# Altium project Smart_Podium.PrjPcb
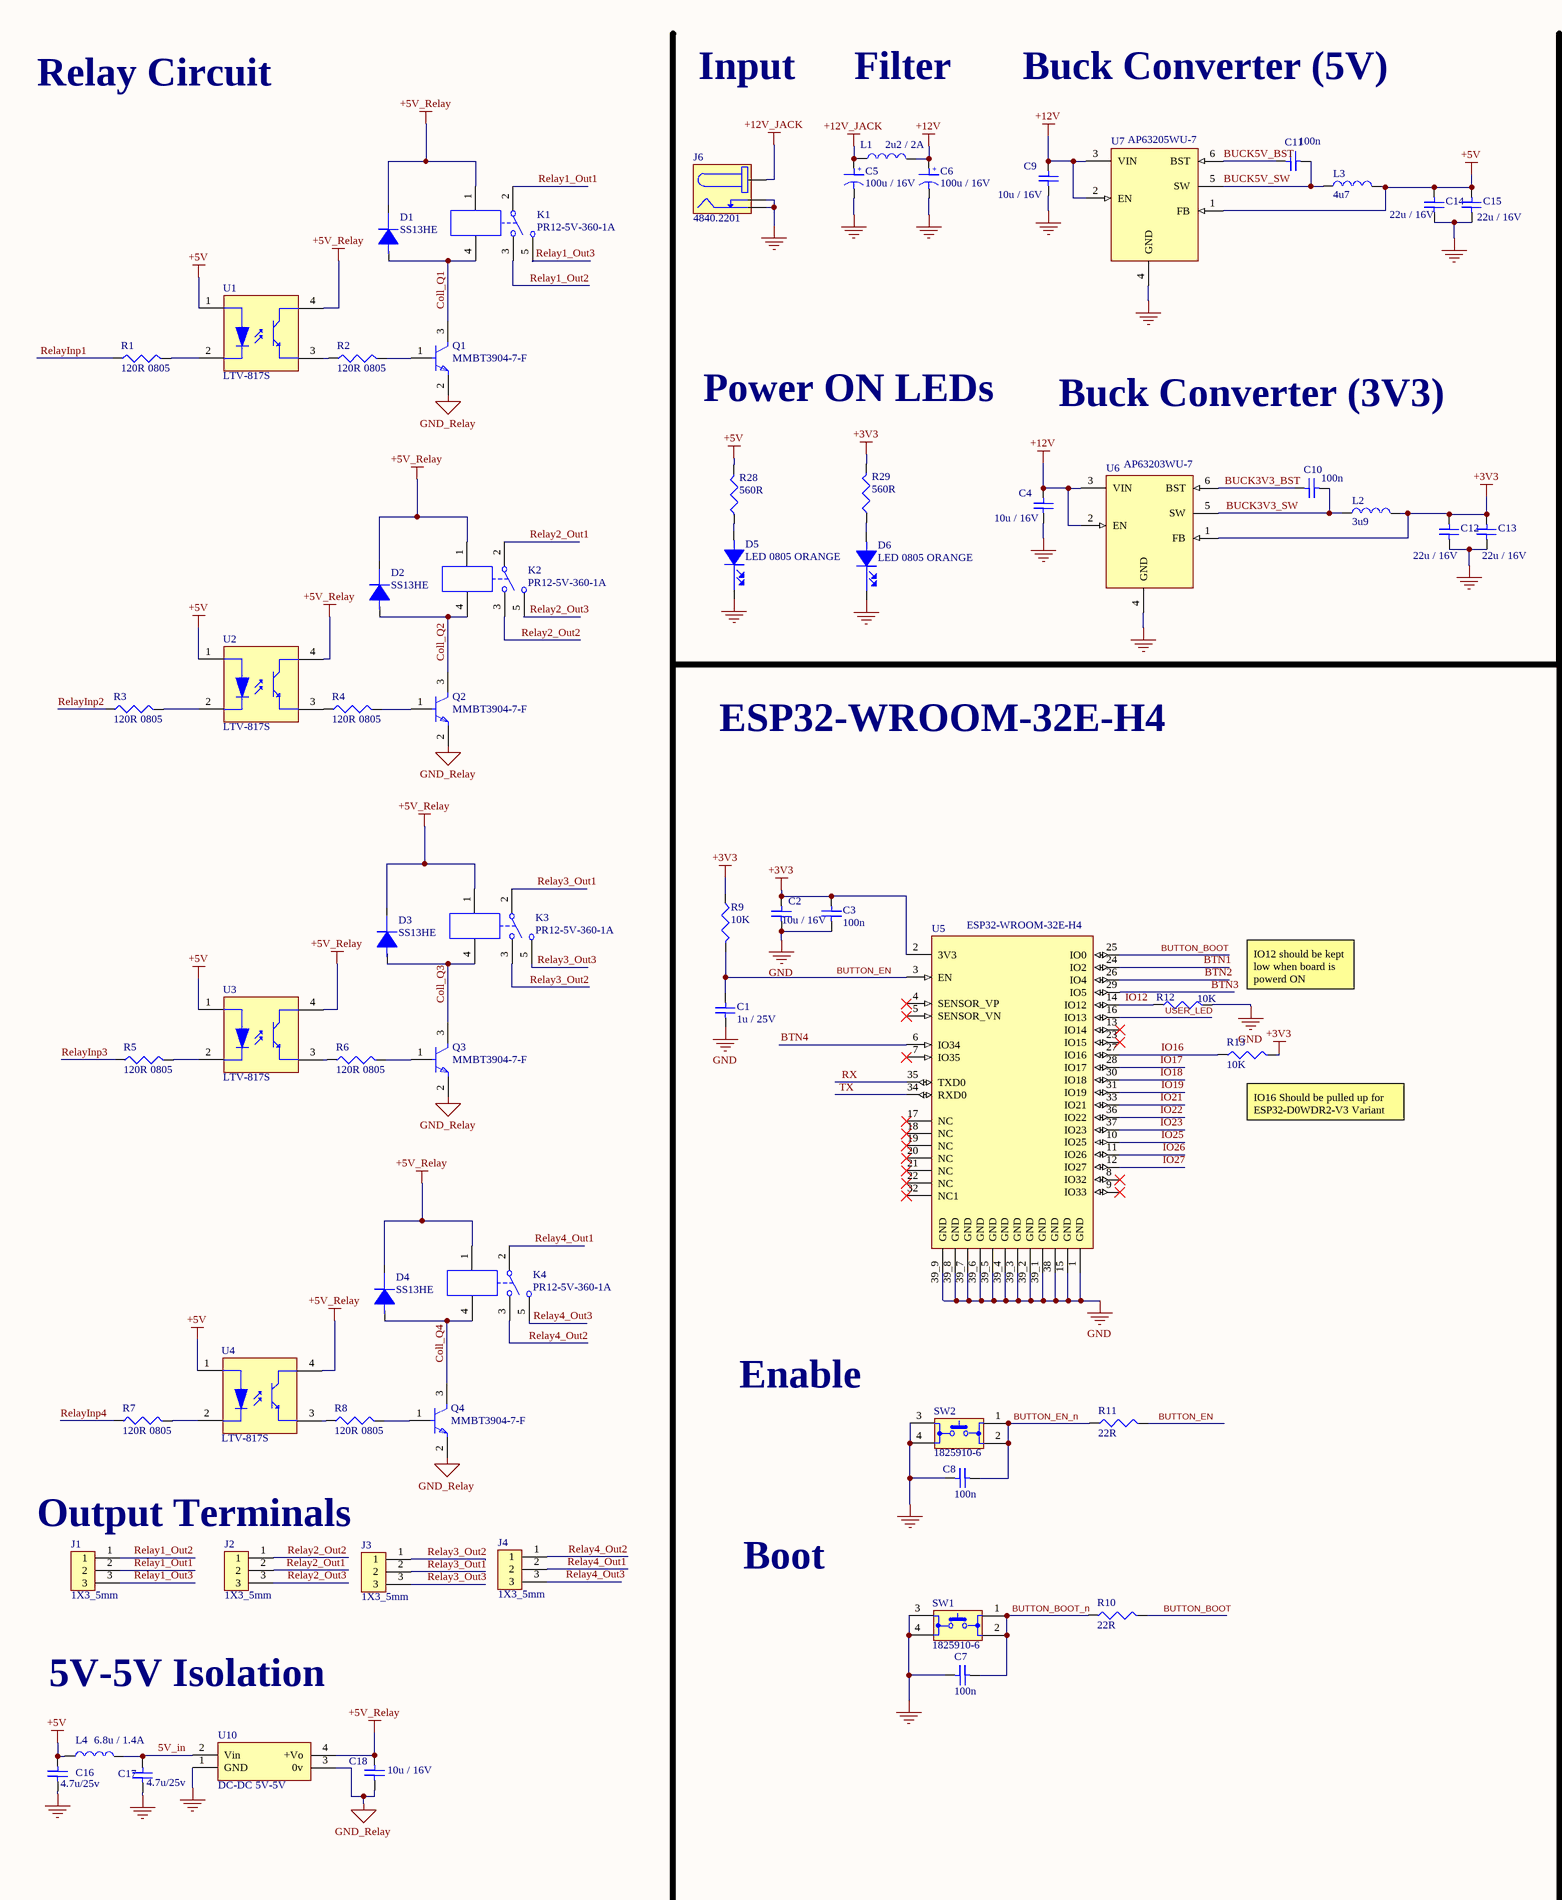
[diagram p0: Smart_Podium_Circuit.SchDoc, left]
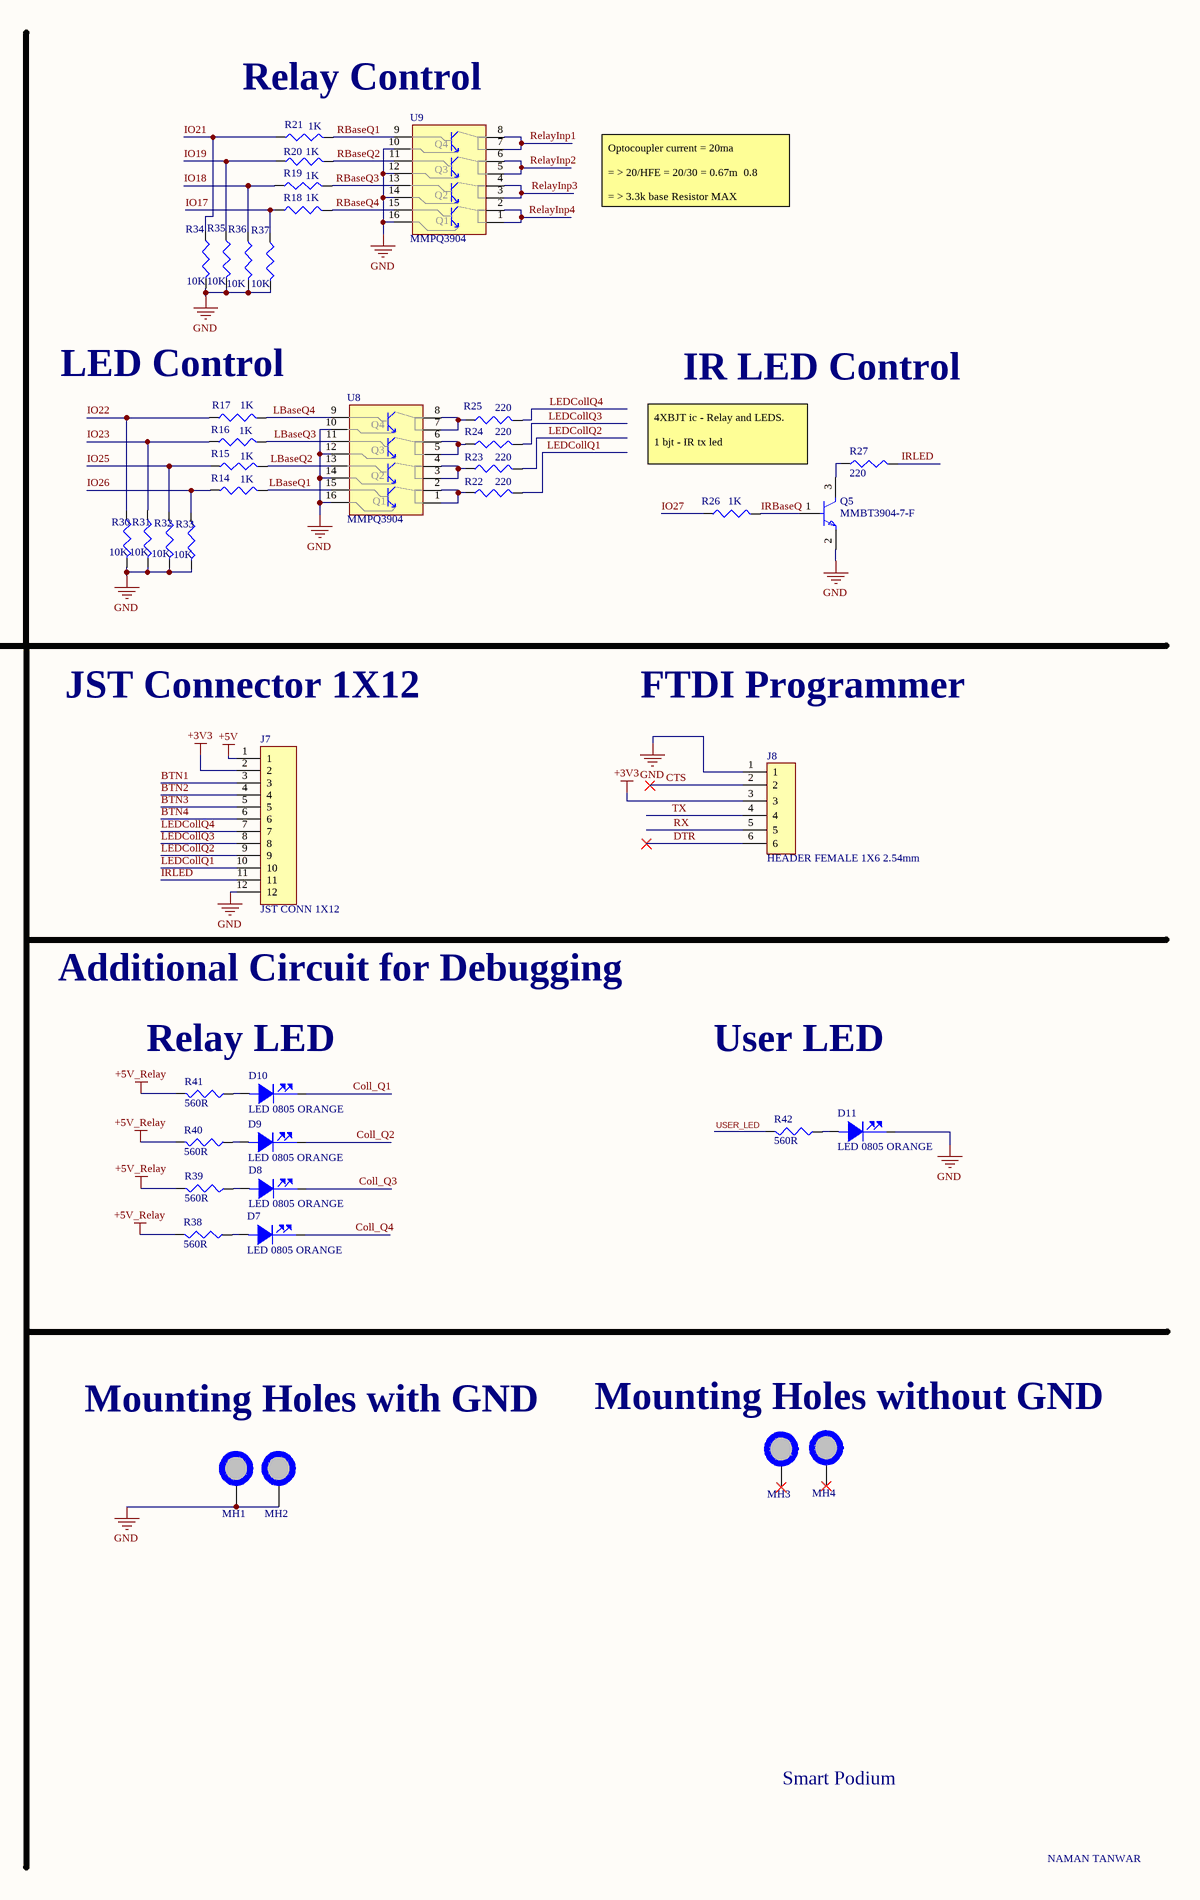
[diagram p1: Smart_Podium_Circuit.SchDoc, right]
1 sheet, 107 parts. Net scope: global (net labels, ports and power ports of the same name join across sheets).
Board file: Smart_Podium.PcbDoc

## Sheet Smart_Podium_Circuit.SchDoc
size A2; SheetNumber: 1; SheetTotal: 1

### Parts
C1  1u / 25V  [C0805]
C2  10u / 16V  [C0805]
C3  100n  [C0805]
C4  10u / 16V  [C0805]
C5  100u / 16V  [C_ALU_C_SIZE]
C6  100u / 16V  [C_ALU_C_SIZE]
C7  100n  [C0805]
C8  100n  [C0805]
C9  10u / 16V  [C0805]
C10  100n  [C0805]
C11  100n  [C0805]
C12  22u / 16V  [C0805]
C13  22u / 16V  [C0805]
C14  22u / 16V  [C0805]
C15  22u / 16V  [C0805]
C16  4.7u/25v  [C0805]
C17  4.7u/25v  [C0805]
C18  10u / 16V  [C0805]
D1  SS13HE  [SOD323HE]
D2  SS13HE  [SOD323HE]
D3  SS13HE  [SOD323HE]
D4  SS13HE  [SOD323HE]
D5  LED 0805 ORANGE  [LED_0805]
D6  LED 0805 ORANGE  [LED_0805]
D7  LED 0805 ORANGE  [LED_0805]
D8  LED 0805 ORANGE  [LED_0805]
D9  LED 0805 ORANGE  [LED_0805]
D10  LED 0805 ORANGE  [LED_0805]
D11  LED 0805 ORANGE  [LED_0805]
J1  1X3_5mm  [SSCREW_CONN_5MM_1X3]
J2  1X3_5mm  [SSCREW_CONN_5MM_1X3]
J3  1X3_5mm  [SSCREW_CONN_5MM_1X3]
J4  1X3_5mm  [SSCREW_CONN_5MM_1X3]
J6  4840.2201  [DC_JACK]
J7  JST CONN 1X12  [FP-B12B-XH-A_LF_SN-MFG]
J8  HEADER FEMALE 1X6 2.54mm  [Header_Female_1x6_2.54mm]
K1  PR12-5V-360-1A  [Relay_SPST]
K2  PR12-5V-360-1A  [Relay_SPST]
K3  PR12-5V-360-1A  [Relay_SPST]
K4  PR12-5V-360-1A  [Relay_SPST]
L1  2u2 / 2A  [C1210_IND]
L2  3u9  [3u9_IND_NON_STANDARD]
L3  4u7  [4u7_IND_NON_STANDARD]
L4  6.8u / 1.4A  [C1210_IND]
MH1  MH_7.4MMC_3.2MMD  [MH_7.4MMC_3.2MMD]  (value not drawn)  (no BOM)
MH2  MH_7.4MMC_3.2MMD  [MH_7.4MMC_3.2MMD]  (value not drawn)  (no BOM)
MH3  MH_7.4MMNC_3.2MMD  [MH_7.4MMC_3.2MMD_NON_COPPER_NPTH]  (value not drawn)  (no BOM)
MH4  MH_7.4MMNC_3.2MMD  [MH_7.4MMC_3.2MMD_NON_COPPER_NPTH]  (value not drawn)  (no BOM)
Q1  MMBT3904-7-F  [FP-SOT23-IPC_A]
Q2  MMBT3904-7-F  [FP-SOT23-IPC_A]
Q3  MMBT3904-7-F  [FP-SOT23-IPC_A]
Q4  MMBT3904-7-F  [FP-SOT23-IPC_A]
Q5  MMBT3904-7-F  [FP-SOT23-IPC_A]
R1  120R 0805  [R0805]
R2  120R 0805  [R0805]
R3  120R 0805  [R0805]
R4  120R 0805  [R0805]
R5  120R 0805  [R0805]
R6  120R 0805  [R0805]
R7  120R 0805  [R0805]
R8  120R 0805  [R0805]
R9  10K  [R0805]
R10  22R  [R0805]
R11  22R  [R0805]
R12  10K  [R0805]
R13  10K  [R0805]
R14  1K  [R0805]
R15  1K  [R0805]
R16  1K  [R0805]
R17  1K  [R0805]
R18  1K  [R0805]
R19  1K  [R0805]
R20  1K  [R0805]
R21  1K  [R0805]
R22  220  [R0805]
R23  220  [R0805]
R24  220  [R0805]
R25  220  [R0805]
R26  1K  [R0805]
R27  220  [R0805]
R28  560R  [R0805]
R29  560R  [R0805]
R30  10K  [R0805]
R31  10K  [R0805]
R32  10K  [R0805]
R33  10K  [R0805]
R34  10K  [R0805]
R35  10K  [R0805]
R36  10K  [R0805]
R37  10K  [R0805]
R38  560R  [R0805]
R39  560R  [R0805]
R40  560R  [R0805]
R41  560R  [R0805]
R42  560R  [R0805]
SW1  1825910-6  [1825910-6]
SW2  1825910-6  [1825910-6]
U1  LTV-817S  [LTST-LTV-817S-4_V]
U2  LTV-817S  [LTST-LTV-817S-4_V]
U3  LTV-817S  [LTST-LTV-817S-4_V]
U4  LTV-817S  [LTST-LTV-817S-4_V]
U5  ESP32-WROOM-32E-H4  [XCVR_ESP32-WROOM-32E_(4MB_HIGH_TEMP)]
U6  AP63203WU-7  [FP-TSOT26-MFG]
U7  AP63205WU-7  [FP-TSOT26-MFG]
U8  MMPQ3904  [16SOIC]
U9  MMPQ3904  [16SOIC]
U10  DC-DC 5V-5V  [DC-DC isolator 1x4 pins]

### Nets
+3V3: C2.2 C3.1 C12.2 C13.2 J7.2 J8.3 L2.2 R9.1 R13.2 R29.2 U5.2(3V3) U6.1(FB)
+5V: C14.2 C15.2 C16.2 J7.1 L3.2 L4.1 R28.2 U1.1(ANODE) U2.1(ANODE) U3.1(ANODE) U4.1(ANODE) U7.1(FB)
+5V_Relay: C18.2 D1.1(Cathode) D2.1(Cathode) D3.1(Cathode) D4.1(Cathode) K1.1 K2.1 K3.1 K4.1 R38.2 R39.2 R40.2 R41.2 U1.4(COLLECTOR) U2.4(COLLECTOR) U3.4(COLLECTOR) U4.4(COLLECTOR) U10.4(+Vo)
+12V: C4.2 C6.1 C9.2 L1.2 U6.2(EN) U6.3(VIN) U7.2(EN) U7.3(VIN)
+12V_JACK: C5.1 J6.1 L1.1
GND: C1.1 C2.1 C3.2 C4.1 C5.2 C6.2 C7.1 C8.1 C9.1 C12.1 C13.1 C14.1 C15.1 C16.1 C17.1 D5.1(Cathode) D6.1(Cathode) D11.1(Cathode) J6.2 J6.3 J7.12 J8.1 MH1.1 MH2.1 Q5.2(E) R12.2 R30.2 R31.2 R32.2 R33.2 R34.2 R35.2 R36.2 R37.2 SW1.3 SW1.4 SW2.3 SW2.4 U5.1(GND) U5.15(GND) U5.38(GND) U5.39_1(GND) U5.39_2(GND) U5.39_3(GND) U5.39_4(GND) U5.39_5(GND) U5.39_6(GND) U5.39_7(GND) U5.39_8(GND) U5.39_9(GND) U6.4(GND) U7.4(GND) U8.10 U8.12 U8.14 U8.16 U9.10 U9.12 U9.14 U9.16 U10.1(GND)
GND_Relay: C18.1 Q1.2(E) Q2.2(E) Q3.2(E) Q4.2(E) U10.3(0v)
5V_in: C17.2 L4.2 U10.2(Vin)
BTN1: J7.3 U5.24(IO2)
BTN2: J7.4 U5.26(IO4)
BTN3: J7.5 U5.29(IO5)
BTN4: J7.6 U5.6(IO34)
BUCK3V3_BST: C10.2 U6.6(BST)
BUCK3V3_SW: C10.1 L2.1 U6.5(SW)
BUCK5V_BST: C11.2 U7.6(BST)
BUCK5V_SW: C11.1 L3.1 U7.5(SW)
BUTTON_BOOT: R10.2 U5.25(IO0)
BUTTON_BOOT_n: C7.2 R10.1 SW1.1 SW1.2
BUTTON_EN: C1.2 R9.2 R11.2 U5.3(EN)
BUTTON_EN_n: C8.2 R11.1 SW2.1 SW2.2
Coll_Q1: D1.2(Anode) D10.1(Cathode) K1.4 Q1.3(C)
Coll_Q2: D2.2(Anode) D9.1(Cathode) K2.4 Q2.3(C)
Coll_Q3: D3.2(Anode) D8.1(Cathode) K3.4 Q3.3(C)
Coll_Q4: D4.2(Anode) D7.1(Cathode) K4.4 Q4.3(C)
CTS: J8.2
DTR: J8.6
IO12: R12.1 U5.14(IO12)
IO16: R13.1 U5.27(IO16)
IO17: R18.1 R37.1 U5.28(IO17)
IO18: R19.1 R36.1 U5.30(IO18)
IO19: R20.1 R35.1 U5.31(IO19)
IO21: R21.1 R34.1 U5.33(IO21)
IO22: R17.1 R30.1 U5.36(IO22)
IO23: R16.1 R31.1 U5.37(IO23)
IO25: R15.1 R32.1 U5.10(IO25)
IO26: R14.1 R33.1 U5.11(IO26)
IO27: R26.1 U5.12(IO27)
IRBaseQ: Q5.1(B) R26.2
IRLED: J7.11 R27.2
LBaseQ1: R14.2 U8.15
LBaseQ2: R15.2 U8.13
LBaseQ3: R16.2 U8.11
LBaseQ4: R17.2 U8.9
LEDCollQ1: J7.10 R22.2
LEDCollQ2: J7.9 R23.2
LEDCollQ3: J7.8 R24.2
LEDCollQ4: J7.7 R25.2
RBaseQ1: R21.2 U9.9
RBaseQ2: R20.2 U9.11
RBaseQ3: R19.2 U9.13
RBaseQ4: R18.2 U9.15
Relay1_Out1: J1.2 K1.2
Relay1_Out2: J1.1 K1.3
Relay1_Out3: J1.3 K1.5
Relay2_Out1: J2.2 K2.2
Relay2_Out2: J2.1 K2.3
Relay2_Out3: J2.3 K2.5
Relay3_Out1: J3.2 K3.2
Relay3_Out2: J3.1 K3.3
Relay3_Out3: J3.3 K3.5
Relay4_Out1: J4.2 K4.2
Relay4_Out2: J4.1 K4.3
Relay4_Out3: J4.3 K4.5
RelayInp1: R1.1 U9.7 U9.8
RelayInp2: R3.1 U9.5 U9.6
RelayInp3: R5.1 U9.3 U9.4
RelayInp4: R7.1 U9.1(C1) U9.2
RX: J8.5 U5.35(TXD0)
TX: J8.4 U5.34(RXD0)
USER_LED: R42.2 U5.16(IO13)
NetD5_2: D5.2(Anode) R28.1
NetD6_2: D6.2(Anode) R29.1
NetD7_2: D7.2(Anode) R38.1
NetD8_2: D8.2(Anode) R39.1
NetD9_2: D9.2(Anode) R40.1
NetD10_2: D10.2(Anode) R41.1
NetD11_2: D11.2(Anode) R42.1
NetQ1_1: Q1.1(B) R2.2
NetQ2_1: Q2.1(B) R4.2
NetQ3_1: Q3.1(B) R6.2
NetQ4_1: Q4.1(B) R8.2
NetQ5_3: Q5.3(C) R27.1
NetR1_2: R1.2 U1.2(CATHODE)
NetR2_1: R2.1 U1.3(EMITTER)
NetR3_2: R3.2 U2.2(CATHODE)
NetR4_1: R4.1 U2.3(EMITTER)
NetR5_2: R5.2 U3.2(CATHODE)
NetR6_1: R6.1 U3.3(EMITTER)
NetR7_2: R7.2 U4.2(CATHODE)
NetR8_1: R8.1 U4.3(EMITTER)
NetR22_1: R22.1 U8.1(C1) U8.2
NetR23_1: R23.1 U8.3 U8.4
NetR24_1: R24.1 U8.5 U8.6
NetR25_1: R25.1 U8.7 U8.8

Not connected (* = marked no-connect by the designer): MH3 1*; MH4 1*; U5 4(SENSOR_VP)* 5(SENSOR_VN)* 7(IO35)* 8(IO32)* 9(IO33)* 13(IO14)* 17(NC)* 18(NC)* 19(NC)* 20(NC)* 21(NC)* 22(NC)* 23(IO15)* 32(NC1)*

### Notes on the sheet
- Relay Circuit
- Input
- Filter
- Buck Converter (5V)
- Relay Control
- Optocoupler current = 20ma
  = > 20/HFE = 20/30 = 0.67m  0.8
  = > 3.3k base Resistor MAX
- Power ON LEDs
- Buck Converter (3V3)
- (near R17) LED Control
- IR LED Control
- 4XBJT ic - Relay and LEDS.
  1 bjt - IR tx led
- JST Connector 1X12
- FTDI Programmer
- ESP32-WROOM-32E-H4
- IO12 should be kept low when board is powerd ON
- Additional Circuit for Debugging
- Relay LED
- User LED
- (near R13) IO16 Should be pulled up for ESP32-D0WDR2-V3 Variant
- Enable
- Mounting Holes with GND
- Mounting Holes without GND
- Output Terminals
- Boot
- 5V-5V Isolation
- Smart Podium
- NAMAN TANWAR
- (in symbol EEE-FN1C101UR) +
- (in symbol MMPQ3904) Q4; Q3; Q2; Q1

### Library data of the parts
C1 = C2012X5R1E105K125AA: CAP CER 1UF 25V X5R 0805; Manufacturer: TDK; Dielectric Material: Ceramic; Tolerance: 10%; Supplier 1: Digi-Key; Manufacturer Part Number: C2012X5R1E105K125AA; RoHS: Yes; Category: Ceramic Capacitors; Stock 1: 84647; Pricing 1: 1=0.21000, 10=0.14500, 50=0.08720, 100=0.07370, 500=0.05042, 1000=0.04460 (USD); Mount: Surface Mount; Case/Package: 0805; Number of Pins: 2; Case Code (Metric): 2012; Case Code (Imperial): 0805; Weight: 0.000194oz; Min Operating Temperature: -55°C; Max Operating Temperature: 85°C; Capacitance: 1uF; Voltage Rating: 25V; Packaging: Tape and Reel; Voltage Rating (DC): 25V; Dielectric: X5R; Termination: SMD/SMT; Construction: Flat; Package Quantity: 2000; Resistor Type: Ceramic; Voltage: 25V; Series: C; Length: 2mm; Width: 0.049inch; Height: 1.25mm; Depth: 1.25mm; Thickness: 0.057inch; Radiation Hardening: No; Lead Free: Lead Free; RoHS Compliant: Yes; Reach SVHC Compliant: Yes; ComponentLink1URL: https://datasheet.ciiva.com/11787/0900766b80c1bb00-11787608.pdf?src-supplier=RSComponents; ComponentLink1Description: https://datasheet.ciiva.com/11787/0900766b80c1bb00-11787608.pdf?src-supplier=RSComponents; ComponentLink2URL: https://datasheet.ciiva.com/16449/e412-c-16449595.pdf?src-supplier=Future+Electronics; ComponentLink2Description: https://datasheet.ciiva.com/16449/e412-c-16449595.pdf?src-supplier=Future+Electronics; ComponentLink3URL: https://datasheet.ciiva.com/28602/1744655-28602171.pdf?src-supplier=Element14; ComponentLink3Description: https://datasheet.ciiva.com/28602/1744655-28602171.pdf?src-supplier=Element14; ComponentLink4URL: https://datasheet.ciiva.com/15192/getdatasheetpartid-726707-15192140.pdf?src-supplier=Verical; ComponentLink4Description: https://datasheet.ciiva.com/15192/getdatasheetpartid-726707-15192140.pdf?src-supplier=Verical; Supplier Part Number 1: 445-1419-1-ND
C2 C4 C9 C18 = CGA4J1X5R1C106M125AC: Cap Ceramic 10uF 16V X5R 20% SMD 0805 85°C Blister Plastic T/R; Manufacturer: TDK; Supplier 1: Digi-Key; Manufacturer Part Number: CGA4J1X5R1C106M125AC; RoHS: Yes; Category: Ceramic Capacitors; Stock 1: 291153; Pricing 1: 1=0.44000, 10=0.30300, 50=0.21200, 100=0.18180, 500=0.13636, 1000=0.11514 (USD); Mount: Surface Mount; Case/Package: 0805; Case Code (Metric): 2012; Case Code (Imperial): 0805; Weight: 0.000194oz; Min Operating Temperature: -55°C; Max Operating Temperature: 85°C; Package Quantity: 2000; Packaging: Tape and Reel; Capacitance: 10uF; Tolerance: 20%; Voltage Rating: 16V; Dielectric: X5R; Termination: SMD/SMT; Voltage Rating (DC): 16V; Series: CGA; Length: 0.079inch; Width: 0.049inch; Height: 1.25mm; Thickness: 0.057inch; Ratings: AEC-Q200; Lead Free: Lead Free; RoHS Compliant: Yes; ComponentLink1URL: https://product.tdk.com/info/en/catalog/datasheets/mlcc_automotive_general_en.pdf?src-supplier=Digi-Key; ComponentLink1Description: https://product.tdk.com/info/en/catalog/datasheets/mlcc_automotive_general_en.pdf?src-supplier=Digi-Key; ComponentLink2URL: https://product.tdk.com/info/en/documents/chara_sheet/CGA4J1X5R1C106M125AC.pdf?src-supplier=Digi-Key; ComponentLink2Description: https://product.tdk.com/info/en/documents/chara_sheet/CGA4J1X5R1C106M125AC.pdf?src-supplier=Digi-Key; ComponentLink3URL: http://product.tdk.com/capacitor/mlcc/detailed_information.php?lang=en&ref=jp&part_no=CGA4J1X5R1C106M125AC&src-supplier=Mouser; ComponentLink3Description: http://product.tdk.com/capacitor/mlcc/detailed_information.php?lang=en&ref=jp&part_no=CGA4J1X5R1C106M125AC&src-supplier=Mouser; ComponentLink4URL: http://product.tdk.com/en/catalog/datasheets/mlcc_automotive_general_en.pdf?src-supplier=Avnet; ComponentLink4Description: http://product.tdk.com/en/catalog/datasheets/mlcc_automotive_general_en.pdf?src-supplier=Avnet; Supplier Part Number 1: 445-12654-1-ND
C3 C7 C8 C10 C11 = C2012X7R1H104M085AA: C Series 0805 0.1 uF 50 V ±20 % Tolerance X7R SMT Multilayer Ceramic Capacitor; Manufacturer: TDK; Capacitance: 100nF; Voltage Rating: 50V; Tolerance: 20%; Supplier 1: Digi-Key; Manufacturer Part Number: C2012X7R1H104M085AA; RoHS: Yes; Category: Ceramic Capacitors; Stock 1: 3401; Pricing 1: 1=0.13000, 10=0.09500, 50=0.05400, 100=0.04480, 500=0.03142, 1000=0.02601 (USD); Mount: Surface Mount; Case/Package: 0805; Number of Pins: 2; Case Code (Metric): 2012; Case Code (Imperial): 0805; Weight: 0.000194oz; Dielectric Material: Ceramic; Min Operating Temperature: -55°C; Max Operating Temperature: 125°C; Packaging: Tape and Reel; Voltage Rating (DC): 50V; Termination: SMD/SMT; Construction: Flat; Package Quantity: 1; Dielectric: X7R; Resistor Type: Ceramic; Series: C; Length: 2mm; Width: 0.049inch; Height: 0.85mm; Thickness: 0.037inch; Depth: 1.25mm; RoHS Compliant: Yes; Lead Free: Lead Free; ComponentLink1URL: https://datasheet.ciiva.com/6256/tdkmlcccaprange-6256917.pdf?src-supplier=Digi-Key; ComponentLink1Description: https://datasheet.ciiva.com/6256/tdkmlcccaprange-6256917.pdf?src-supplier=Digi-Key; ComponentLink2URL: https://datasheet.ciiva.com/6256/tdkmlcccaprange-6256919.pdf?src-supplier=Digi-Key; ComponentLink2Description: https://datasheet.ciiva.com/6256/tdkmlcccaprange-6256919.pdf?src-supplier=Digi-Key; Supplier Part Number 1: 445-7535-1-ND
C5 C6 = EEE-FN1C101UR: Cap Aluminum 100uF 16V 20% Cylindrical 0.7 Ohm 160mA 2000 hr 105°C Emboss T/R; Manufacturer: Panasonic; Supplier 1: Digi-Key; Manufacturer Part Number: EEE-FN1C101UR; RoHS: No; Category: Capacitors; Stock 1: 1049; Pricing 1: 1=0.55000, 10=0.38600, 50=0.29220, 100=0.25450, 500=0.18850 (USD); Supplier Part Number 1: 10-EEE-FN1C101URCT-ND
C12-C15 = CL31A226MOCLNNC: Cap Ceramic 22uF 16V X5R 20% SMD 1206 85°C Cardboard T/R; Manufacturer: Samsung; Supplier 1: Digi-Key; Manufacturer Part Number: CL31A226MOCLNNC; RoHS: Yes; Category: Ceramic Capacitors; Stock 1: 605129; Pricing 1: 1=0.23000, 10=0.16000, 50=0.10640, 100=0.09040, 500=0.06382, 1000=0.05585 (USD); Mount: Surface Mount; Case/Package: 1206; Case Code (Metric): 3216; Case Code (Imperial): 1206; Min Operating Temperature: -55°C; Max Operating Temperature: 85°C; Packaging: Tape and Reel; Tolerance: 20%; Capacitance: 22uF; Package Quantity: 1; Voltage Rating: 16V; Dielectric: X5R; Series: CL; Construction: Flat; Voltage: 16V; Length: 3.2mm; Width: 0.063inch; Height: 0.85mm; Thickness: 0.037inch; Depth: 1.6mm; Radiation Hardening: No; Lead Free: Lead Free; RoHS Compliant: Yes; ComponentLink1URL: https://datasheet.ciiva.com/25793/cl31a226moclnnc-25793126.pdf?src-supplier=Digi-Key; ComponentLink1Description: https://datasheet.ciiva.com/25793/cl31a226moclnnc-25793126.pdf?src-supplier=Digi-Key; ComponentLink2URL: https://datasheet.ciiva.com/26838/getdatasheetpartid-353197-26838865.pdf?src-supplier=Verical; ComponentLink2Description: https://datasheet.ciiva.com/26838/getdatasheetpartid-353197-26838865.pdf?src-supplier=Verical; Supplier Part Number 1: 1276-2728-1-ND
C16 C17 = TMK212ABJ475KG-T: Multilayer Ceramic Capacitors (High dielectric type), 25V, 4.7 uF, ± 10 %, 0805, X5R, RoHS; Manufacturer: Taiyo Yuden; Value: 4.7uF; Tolerance: 10%; Supplier 1: Digi-Key; Manufacturer Part Number: TMK212ABJ475KG-T; RoHS: Yes; Category: Ceramic Capacitors; Stock 1: 38178; Pricing 1: 1=0.17000, 10=0.11800, 50=0.06680, 100=0.05540, 500=0.03882, 1000=0.03213 (USD); Mounting Technology: Surface Mount; Case/Package: Ceramic; Contact Plating: Tin; Min Operating Temperature: -55°C; Max Operating Temperature: 85°C; Dielectric: X5R; Termination: Wraparound; Length: 2mm; RoHS Compliant: Yes; ComponentLink1URL: http://www.farnell.com/datasheets/2819920.pdf?src-supplier=Farnell; ComponentLink1Description: http://www.farnell.com/datasheets/2819920.pdf?src-supplier=Farnell; ComponentLink2URL: http://www.farnell.com/datasheets/2819920.pdf?src-supplier=Newark; ComponentLink2Description: http://www.farnell.com/datasheets/2819920.pdf?src-supplier=Newark; ComponentLink3URL: https://ds.yuden.co.jp/TYCOMPAS/ut/detail?pn=TMK212ABJ475KG-T&amp;u=M&src-supplier=Digi-Key; ComponentLink3Description: https://ds.yuden.co.jp/TYCOMPAS/ut/detail?pn=TMK212ABJ475KG-T&amp;u=M&src-supplier=Digi-Key; Supplier Part Number 1: 587-5478-1-ND
D1-D4 = SS13HE: SS13HE Series 30 V 1 A Surface Mount Schottky Barrier Rectifier - SOD-323HE; Manufacturer: ON Semiconductor / Fairchild; Average Rectified Current: 1A; Max Reverse Voltage (DC): 30V; Element Configuration: Single; Reverse Recovery Time: 5.6ns; Max Forward Surge Current (Ifsm): 25A; Supplier 1: Digi-Key; Manufacturer Part Number: SS13HE; RoHS: No; Category: Schottky Diodes; Stock 1: 1894; Pricing 1: 1=0.42000, 10=0.34100, 100=0.23240, 500=0.17426, 1000=0.13070 (USD); Mounting Technology: Surface Mount; Case/Package: SMD/SMT; Weight: 0.006g; Packaging: Tape and Reel; Max Repetitive Reverse Voltage (Vrrm): 30V; RoHS Compliant: No; ComponentLink1URL: https://www.fairchildsemi.com/datasheets/SS/SS13HE.pdf?src-supplier=Digi-Key; ComponentLink1Description: https://www.fairchildsemi.com/datasheets/SS/SS13HE.pdf?src-supplier=Digi-Key; Supplier Part Number 1: SS13HECT-ND
D5-D11 = LOR976-PS-1: Orange LED 0805 Vf = 2V, 20mA; Manufacturer: Osram Opto; Lens Color: White; Viewing Angle: 160°; Lens Style: Flat,Rectangular,Diffused,Colorless; Forward Current: 25mA; Luminous Intensity: 162.5mcd; Dominant Wavelength: 606nm; Luminous Flux: 0.735lm; Reverse Voltage: 12V; Lens Transparency: Diffused; Number of LEDs: 1; Lens Size: 1.25mm; Supplier 1: Arrow Electronics; Manufacturer Part Number: LOR976-PS-1; RoHS: Yes; Category: LEDs; Stock 1: 2418; Pricing 1: 1=0.27100, 10=0.15400, 25=0.15270, 100=0.07290, 250=0.07210, 500=0.06600, 1000=0.05150 (USD); Mount: Surface Mount; Case/Package: 0805; Number of Pins: 2; Color: Orange; Case Code (Metric): 2012; Case Code (Imperial): 0805; Contact Plating: Tin,Matte; Min Operating Temperature: -30°C; Max Operating Temperature: 85°C; Packaging: Tape and Reel; Forward Voltage: 2V; Test Current: 20mA; Package Quantity: 16000; Illumination Color: Orange; Series: CHIPLED 0805; Length: 2mm; Width: 1.25mm; Height: 0.9mm; Radiation Hardening: No; RoHS Compliant: Yes; ComponentLink1URL: https://datasheet.ciiva.com/2119/00078881-0-2119287.pdf?src-supplier=Digi-Key; ComponentLink1Description: https://datasheet.ciiva.com/2119/00078881-0-2119287.pdf?src-supplier=Digi-Key; ComponentLink2URL: https://datasheet.ciiva.com/2119/00078881-0-2119286.pdf?src-supplier=Digi-Key; ComponentLink2Description: https://datasheet.ciiva.com/2119/00078881-0-2119286.pdf?src-supplier=Digi-Key; ComponentLink3URL: https://datasheet.ciiva.com/2119/00078881-0-2119288.pdf?src-supplier=Digi-Key; ComponentLink3Description: https://datasheet.ciiva.com/2119/00078881-0-2119288.pdf?src-supplier=Digi-Key; Supplier Part Number 1: LO R976-PS-1
J1-J4 = 1935174: Terminal Block Header 3 Position Top Screw 0.197" (5.00mm) PC Pins; Manufacturer: Phoenix Contact; Number of Contacts: 3; Max Current Rating: 16A; Voltage Rating: 250V; Current Rating: 17.5A; Number of Levels: 1; Current: 18A; Voltage: 300V; Voltage Rating (DC): 320V; Wire Gauge (Max): 26AWG; Wire Gauge (Min): 12AWG; Pitch: 5mm; Approvals: UL,VDE,CB,EAC; Supplier 1: Digi-Key; Manufacturer Part Number: 1935174; RoHS: Yes; Category: Terminal Blocks; Stock 1: 144266; Pricing 1: 1=0.75000, 10=0.65600, 50=0.62700, 100=0.60990, 250=0.57000, 500=0.52440, 1000=0.51000 (USD); Mount: Through Hole; Number of Pins: 3; Contact Material: Copper,Tin; Color: Green; Housing Material: Polyamide; Weight: 0.100531oz; Material: Nylon; Housing Color: Green; Insulation Material: Nylon; Termination: Solder; Packaging: Bulk; Number of Rows: 1; Max Supply Voltage: 250V; Number of Positions: 3; Orientation: Straight; Series: COMBICON PT; Package Quantity: 250; Number of Poles: 3; Number of Positions Per Level: 3; Number of Circuits: 3; Number of Ways: 3; Length: 9mm; Width: 15mm; Height: 11.3mm; Depth: 9mm; Wire/Cable Gauge: 26AWG; Stripping Length: 5mm; Radiation Hardening: No; RoHS Compliant: Yes; Lead Free: Lead Free; Flammability Rating: UL94 V-0; ComponentLink1URL: https://datasheet.ciiva.com/16047/1935174-16047249.pdf?src-supplier=Onlinecomponents.com; ComponentLink1Description: https://datasheet.ciiva.com/16047/1935174-16047249.pdf?src-supplier=Onlinecomponents.com; ComponentLink2URL: https://datasheet.ciiva.com/15169/getdatasheetpartid-212213-15169949.pdf?src-supplier=Verical; ComponentLink2Description: https://datasheet.ciiva.com/15169/getdatasheetpartid-212213-15169949.pdf?src-supplier=Verical; ComponentLink3URL: https://datasheet.ciiva.com/823/combiconcompact5-0mmseries-823761.pdf?src-supplier=Digi-Key; ComponentLink3Description: https://datasheet.ciiva.com/823/combiconcompact5-0mmseries-823761.pdf?src-supplier=Digi-Key; ComponentLink4URL: https://datasheet.ciiva.com/29218/744167-da-01-en-printklemme-pt-1-5-3-5-0-h-29218252.pdf?src-supplier=Conrad; ComponentLink4Description: https://datasheet.ciiva.com/29218/744167-da-01-en-printklemme-pt-1-5-3-5-0-h-29218252.pdf?src-supplier=Conrad; Supplier Part Number 1: 277-1578-ND
J6 = 4840.2201: DC Connector Socket 6x2mm 2-Pole 12VDC 0.5A 500VDC Dielectric Solder Term PCB Mt; Manufacturer: Schurter; Number of Terminals/Pins: 3; Gender: Male; Shielding: Unshielded; Current Rating: 500mA; Voltage Rating: 12V; Number of Ports: 1; Connector Type: Jack; Pin Diameter: 2mm; Supplier 1: Digi-Key; Manufacturer Part Number: 4840.2201; RoHS: Yes; Category: Connectors; Stock 1: 9153; Pricing 1: 1=1.82000, 50=1.67900, 100=1.41120 (USD); Mounting Technology: Through Hole; Color: Black; Contact Material: Copper Alloy; Housing Material: PC; Weight: 0.007125oz; Contact Plating: Tin; Housing Color: Black; Termination: Solder; Number of Contacts: 3; Orientation: Right Angle; Package Quantity: 500; Series: 4840; Length: 9mm; Width: 9mm; Depth: 14.5mm; Radiation Hardening: No; Lead Free: Lead Free; RoHS Compliant: Yes; ComponentLink1URL: https://datasheet.ciiva.com/26837/getdatasheetpartid-572408-26837414.pdf?src-supplier=Verical; ComponentLink1Description: https://datasheet.ciiva.com/26837/getdatasheetpartid-572408-26837414.pdf?src-supplier=Verical; ComponentLink2URL: https://datasheet.ciiva.com/16318/typ-4840-1200-16318967.pdf?src-supplier=Future+Electronics; ComponentLink2Description: https://datasheet.ciiva.com/16318/typ-4840-1200-16318967.pdf?src-supplier=Future+Electronics; ComponentLink3URL: https://datasheet.ciiva.com/12342/typ-4840-2201-65401-12342879.pdf?src-supplier=Mouser; ComponentLink3Description: https://datasheet.ciiva.com/12342/typ-4840-2201-65401-12342879.pdf?src-supplier=Mouser; ComponentLink4URL: https://datasheet.ciiva.com/391/typ-4840-2201-391834.pdf?src-supplier=Digi-Key; ComponentLink4Description: https://datasheet.ciiva.com/391/typ-4840-2201-391834.pdf?src-supplier=Digi-Key; Supplier Part Number 1: 486-3381-ND
J7 = B12B-XH-A(LF)(SN): CONN HEADER VERT 12POS 2.5MM; Mated Stacking Heights: 9.8mm; Voltage Rating: 250V; Number of Positions: 12; Manufacturer Part Number: B12B-XH-A(LF)(SN); Flammability Rating: UL94 V-0; Fastening Type: Detent; Contact Type: Male Pin; Insulation Color: Natural; Contact Material: Brass; Min Operating Temperature: -25°C; Contact Shape: Square; Height: 0.5inch; Connector Type: Header; Max Operating Temperature: 85°C; Number of Rows: 1; Series: XH; Insulation Material: Nylon; Contact Finish - Mating: TIN; Mount: Through Hole; Width: 0.5inch; Weight: 0.0625lb; Termination: Press-Fit; Length: 1.5inch; Packaging: Bulk
J8 = PPTC061LFBN-RC: Female, 6 C, Straight, .100"CC; 3.20mm Tail, No Mt. 100u" Tin; PBT, Phos Bronze, 105 C; Manufacturer: Sullins; Supplier 1: Digi-Key; Manufacturer Part Number: PPTC061LFBN-RC; RoHS: Yes; Category: Connectors; Stock 1: 62927; Pricing 1: 1=0.52000, 10=0.44900, 80=0.37050, 440=0.32220, 1000=0.26582, 5000=0.23360, 10000=0.23270 (USD); ComponentLink1URL: https://media.digikey.com/pdf/Data%20Sheets/Sullins%20PDFs/Female_Headers.100_DS.pdf?src-supplier=Digi-Key; ComponentLink1Description: https://media.digikey.com/pdf/Data%20Sheets/Sullins%20PDFs/Female_Headers.100_DS.pdf?src-supplier=Digi-Key; ComponentLink2URL: http://www.sullinscorp.com/catalogs/78_Page80-81_HEADER_.100_2.54mm_FEMALE.pdf?src-supplier=Future+Electronics; ComponentLink2Description: http://www.sullinscorp.com/catalogs/78_Page80-81_HEADER_.100_2.54mm_FEMALE.pdf?src-supplier=Future+Electronics; Supplier Part Number 1: S7004-ND
K1-K4 = PR12-5V-360-1A: Power Relay 5VDC 15A SPST-NO(19mm 15.5mm 15.8mm) THT; Manufacturer: CUI Devices; Supplier 1: Digi-Key; Manufacturer Part Number: PR12-5V-360-1A; RoHS: No; Category: Power Relays; Stock 1: 985; Pricing 1: 1=1.03000, 10=0.96900, 25=0.86080, 50=0.81800, 100=0.77490, 250=0.68880, 500=0.64576, 1000=0.60270, 5000=0.58118 (USD); Supplier Part Number 1: 2223-PR12-5V-360-1A-ND
L1 = L1210R2R2MDWIT: Inductor RF Chip Wirewound 2.2uH 20% 100KHz 1.13A 0.104Ohm DCR 1210 T/R; Manufacturer: KEMET; Core Material: Ferrite; Shielding: Unshielded; Self Resonant Frequency: 190MHz; DC Resistance (DCR): 80mR; Supplier 1: Farnell; Manufacturer Part Number: L1210R2R2MDWIT; RoHS: Yes; Category: Fixed Inductors; Stock 1: 12; Pricing 1: 1=0.29100, 50=0.27000, 100=0.24900, 250=0.23600, 500=0.22300, 1000=0.16900, 5000=0.16400, 10000=0.15800 (GBP); Mount: Surface Mount; Case/Package: 1210; Case Code (Metric): 3225; Case Code (Imperial): 1210; Min Operating Temperature: -40°C; Max Operating Temperature: 105°C; Tolerance: 20%; Inductance: 2.2uH; Max DC Current: 2A; Package Quantity: 1000; Current Rating: 2A; Packaging: Tape and Reel; Inductance Tolerance: 20%; Resistor Type: Wirewound,Ceramic; Test Frequency: 100kHz; Termination: SMD/SMT; DC Current: 1.13A; Series: L-DWI; Length: 3.2mm; Width: 2.5mm; Height: 2.5mm; Height - Seated (Max): 0.106inch; Depth: 2.7mm; Radiation Hardening: No; Reach SVHC Compliant: Yes; Military Standard: Not; RoHS Compliant: Yes; ComponentLink1URL: https://datasheet.ciiva.com/4957/f3115-4957838.pdf?src-supplier=Mouser; ComponentLink1Description: https://datasheet.ciiva.com/4957/f3115-4957838.pdf?src-supplier=Mouser; ComponentLink2URL: https://datasheet.ciiva.com/6691/f3115-6691487.pdf?src-supplier=Digi-Key; ComponentLink2Description: https://datasheet.ciiva.com/6691/f3115-6691487.pdf?src-supplier=Digi-Key; ComponentLink3URL: https://datasheet.ciiva.com/8512/f3115-8512543.pdf?src-supplier=Avnet; ComponentLink3Description: https://datasheet.ciiva.com/8512/f3115-8512543.pdf?src-supplier=Avnet; ComponentLink4URL: https://datasheet.ciiva.com/22685/27262-22685038.pdf?src-supplier=Element14; ComponentLink4Description: https://datasheet.ciiva.com/22685/27262-22685038.pdf?src-supplier=Element14; Supplier Part Number 1: 3638976
L2 = SRR4828A-3R9Y: Inductor Power Shielded Wirewound 3.9uH 30% 100KHz Ferrite 3.4A 0.047Ohm DCR Automotive T/R; Manufacturer: Bourns; Value: 15uH; Tolerance: 20%; Current Rating: 1.8A; Saturation Current: 920mA; DC Resistance (DCR): 145mR; Self Resonant Frequency: 25MHz; Supplier 1: Digi-Key; Manufacturer Part Number: SRR4828A-3R9Y; RoHS: Yes; Category: Fixed Inductors; Stock 1: 859; Pricing 1: 1=1.02000, 10=0.89600, 25=0.83240, 50=0.70420, 100=0.64020, 250=0.60184 (USD); Mounting Technology: Surface Mount; Case/Package: Nonstandard; Core Material: Ferrite; Min Operating Temperature: -40°C; Max Operating Temperature: 150°C; Resistor Type: Wirewound; Packaging: Cut Tape; Shielding: Shielded; Test Frequency: 100kHz; Ratings: AEC-Q200; RoHS Compliant: Yes; ComponentLink1URL: http://www.farnell.com/datasheets/2339105.pdf?src-supplier=Farnell; ComponentLink1Description: http://www.farnell.com/datasheets/2339105.pdf?src-supplier=Farnell; ComponentLink2URL: https://www.bourns.com/docs/Product-Datasheets/SRR4828A.pdf?src-supplier=Digi-Key; ComponentLink2Description: https://www.bourns.com/docs/Product-Datasheets/SRR4828A.pdf?src-supplier=Digi-Key; Supplier Part Number 1: SRR4828A-3R9YCT-ND
L3 = SRR4828A-4R7Y: Inductor Power Shielded Wirewound 4.7uH 30% 100KHz Ferrite 3A 0.054Ohm DCR Automotive T/R; Manufacturer: Bourns; Saturation Current: 1.6A; DC Resistance (DCR): 54mR; Self Resonant Frequency: 50MHz; Supplier 1: Digi-Key; Manufacturer Part Number: SRR4828A-4R7Y; RoHS: Yes; Category: Fixed Inductors; Stock 1: 2297; Pricing 1: 1=1.02000, 10=0.89600, 25=0.83240, 50=0.70420, 100=0.64020, 250=0.60184 (USD); Mounting Technology: Surface Mount; Case/Package: Nonstandard; Core Material: Ferrite; Min Operating Temperature: -40°C; Max Operating Temperature: 150°C; Resistor Type: Wirewound; Packaging: Cut Tape; Value: 4.7uH; Tolerance: 30%; Current Rating: 3A; Shielding: Shielded; Test Frequency: 100kHz; Ratings: AEC-Q200; RoHS Compliant: Yes; ComponentLink1URL: https://www.bourns.com/docs/Product-Datasheets/SRR4828A.pdf?src-supplier=Digi-Key; ComponentLink1Description: https://www.bourns.com/docs/Product-Datasheets/SRR4828A.pdf?src-supplier=Digi-Key; Supplier Part Number 1: SRR4828A-4R7YCT-ND
L4 = TFM322512ALMA6R8MTAA: Inductor Power Shielded Thin Film 6.8uH 20% 1MHz Metal 1.4A 0.26Ohm DCR 1210 Automotive T/R; Manufacturer: TDK; Supplier 1: Digi-Key; Manufacturer Part Number: TFM322512ALMA6R8MTAA; RoHS: Yes; Category: Fixed Inductors; Stock 1: 3686; Pricing 1: 1=0.97000, 10=0.90300, 25=0.83360, 50=0.69460, 100=0.65290, 250=0.58348, 500=0.50014, 1000=0.44456 (USD); Supplier Part Number 1: 445-TFM322512ALMA6R8MTAACT-ND
MH1 MH2 = MH_7.4MMC_3.2MMD: Mounting Hole 7.4mm Diameter, 3.2mm Drill
MH3 MH4 = MH_7.4MMNC_3.2MMD: Mounting Hole Non Copper 7.4mm Diameter, 3.2mm Drill NPTH
Q1-Q5 = CMP-2000-04931-2: TRANS NPN 40V 0.2A SMD SOT23-3; Frequency: 300MHz; Power Dissipation: 350mW; Element Configuration: Single; Max Power Dissipation: 300mW; Max Collector Current: 200mA; Collector Emitter Saturation Voltage: 300mV; Number of Elements: 1; hFE Min: 100; Collector Base Voltage (VCBO): 60V; Emitter Base Voltage (VEBO): 6V; Contact Plating: Tin; Package Quantity: 3000; Max Frequency: 300MHz; REACH SVHC: No SVHC; Max Operating Temperature: 150°C; Width: 1.4mm; Collector Emitter Voltage (VCEO): 40V; Voltage Rating (DC): 40V; Radiation Hardening: No; Case/Package: SOT-23; Height: 1mm; Collector Emitter Breakdown Voltage: 40V; Length: 3.05mm; Polarity: NPN; Packaging: Tape and Reel; Number of Pins: 3; Min Operating Temperature: -55°C; Gain Bandwidth Product: 300MHz; Mount: Surface Mount; Weight: 0.000282oz; Continuous Collector Current: 200mA; Transition Frequency: 300MHz; Max Breakdown Voltage: 40V; Lead Free: Lead Free
R1-R8 = RNCF0805DTE120R: Res Thin Film 0805 120 Ohm 0.5% 1/10W ±25ppm/°C Molded SMD SMD Paper T/R; Manufacturer: Stackpole Electronics; Supplier 1: Digi-Key; Manufacturer Part Number: RNCF0805DTE120R; RoHS: Yes; Category: Chip SMD Resistors; Stock 1: 3905; Pricing 1: 1=0.14000, 10=0.11600, 100=0.04520, 1000=0.01890, 2500=0.01732 (USD); ComponentLink1URL: https://www.seielect.com/catalog/sei-rncf.pdf?src-supplier=Digi-Key; ComponentLink1Description: https://www.seielect.com/catalog/sei-rncf.pdf?src-supplier=Digi-Key; Supplier Part Number 1: 738-RNCF0805DTE120RCT-ND; Mounting Technology: Surface Mount; Case/Package: 0805; Contact Plating: Tin,Matte; Min Operating Temperature: -55°C; Max Operating Temperature: 155°C; Temperature Coefficient: 25ppm/°C; Resistor Type: Thin Film; Packaging: Tape and Reel; Value: 120R; Tolerance: 0.5%; Radiation Hardening: No; ComponentLink2URL: https://www.seielect.com/Catalog/SEI-rncf.pdf?src-supplier=Avnet; ComponentLink2Description: https://www.seielect.com/Catalog/SEI-rncf.pdf?src-supplier=Avnet
R9 R12 R13 R30-R37 = RC0805FR-0710KL: Res Thick Film 0805 10K Ohm 1% 0.125W(1/8W) +/-100ppm/C Epoxy Pad SMD T/R; Manufacturer: Yageo; Resistance: 10kR; Temperature Coefficient: 100ppm/°C; Power Rating: 125mW; Voltage Rating: 150V; Supplier 1: Digi-Key; Manufacturer Part Number: RC0805FR-0710KL; RoHS: Yes; Category: Chip SMD Resistors; Stock 1: 11681830; Pricing 1: 1=0.10000, 10=0.03700, 100=0.01490, 1000=0.00669, 2500=0.00581 (USD); Case/Package: 0805; Case Code (Imperial): 0805; Case Code (Metric): 2012; Size Code: 0805; Min Operating Temperature: -55°C; Max Operating Temperature: 155°C; Packaging: Tape and Reel; Tolerance: 1%; Resistor Type: Thick Film; Package Quantity: 1; Termination: SMD/SMT; Number of Terminations: 2; Max Power Dissipation: 125mW; Features: Moisture Resistant; Series: RC; Construction: Rectangular; Resistance Tolerance: 1%; Technology: THICK FILM; Length: 0.079inch; Width: 0.049inch; Height: 0.024inch; Depth: 1.25mm; Lead Free: Lead Free; Military Standard: Not; RoHS Compliant: Yes; Supplier Part Number 1: 311-10.0KCRCT-ND
R10 R11 = RC0805FR-0722RL: Res Thick Film 0805 22 Ohm 1% 0.125W(1/8W) ±100ppm/C Pad SMD T/R; Manufacturer: Yageo; Temperature Coefficient: 100ppm/°C; Power Rating: 125mW; Voltage Rating: 150V; Supplier 1: Digi-Key; Manufacturer Part Number: RC0805FR-0722RL; RoHS: Yes; Category: Chip SMD Resistors; Stock 1: 326034; Pricing 1: 1=0.10000, 10=0.03600, 100=0.01480, 1000=0.00666, 2500=0.00578 (USD); Case/Package: 0805; Case Code (Metric): 2012; Case Code (Imperial): 0805; Min Operating Temperature: -55°C; Max Operating Temperature: 155°C; Resistor Type: Thick Film; Resistance: 22R; Tolerance: 1%; Packaging: Tape and Reel; Package Quantity: 1; Number of Terminations: 2; Termination: SMD/SMT; Max Power Dissipation: 125mW; Working Voltage: 150V; Features: Moisture Resistant; Series: RC; Resistance Tolerance: 1%; Construction: Rectangular; Technology: THICK FILM; Length: 0.079inch; Width: 0.049inch; Height: 0.024inch; Depth: 1.25mm; Lead Free: Lead Free; RoHS Compliant: Yes; Military Standard: Not; ComponentLink1URL: https://datasheet.ciiva.com/11819/0900766b8106beab-11819837.pdf?src-supplier=RSComponents; ComponentLink1Description: https://datasheet.ciiva.com/11819/0900766b8106beab-11819837.pdf?src-supplier=RSComponents; ComponentLink2URL: https://datasheet.ciiva.com/46447/444164-46447574.pdf?src-supplier=Element14; ComponentLink2Description: https://datasheet.ciiva.com/46447/444164-46447574.pdf?src-supplier=Element14; ComponentLink3URL: https://datasheet.ciiva.com/2457/pyu-r-int-thick-7-2457045.pdf?src-supplier=Digi-Key; ComponentLink3Description: https://datasheet.ciiva.com/2457/pyu-r-int-thick-7-2457045.pdf?src-supplier=Digi-Key; ComponentLink4URL: https://datasheet.ciiva.com/2457/pyu-r-int-thick-7-2457046.pdf?src-supplier=Digi-Key; ComponentLink4Description: https://datasheet.ciiva.com/2457/pyu-r-int-thick-7-2457046.pdf?src-supplier=Digi-Key; ComponentLink5URL: https://datasheet.ciiva.com/2457/pyu-r-int-thick-7-2457044.pdf?src-supplier=Digi-Key; ComponentLink5Description: https://datasheet.ciiva.com/2457/pyu-r-int-thick-7-2457044.pdf?src-supplier=Digi-Key; ComponentLink6URL: https://datasheet.ciiva.com/12667/rc0805-12667371.pdf?src-supplier=Mouser; ComponentLink6Description: https://datasheet.ciiva.com/12667/rc0805-12667371.pdf?src-supplier=Mouser; Supplier Part Number 1: 311-22.0CRDKR-ND
R14-R21 R26 = RNCP0805FTD1K00: Res Thin Film 0805 1K Ohm 1% 0.25W(1/4W) ±100ppm/C Sulfur Resistant Pad SMD T/R; Manufacturer: Stackpole Electronics; Resistance: 1kR; Power Rating: 250mW; Temperature Coefficient: 100ppm/°C; Supplier 1: Digi-Key; Manufacturer Part Number: RNCP0805FTD1K00; RoHS: Yes; Category: Chip SMD Resistors; Stock 1: 359931; Pricing 1: 1=0.10000, 10=0.07300, 100=0.02970, 1000=0.01336, 2500=0.01159 (USD); Mount: Surface Mount; Case/Package: 0805; Case Code (Metric): 2012; Case Code (Imperial): 0805; Size Code: 0805; Min Operating Temperature: -55°C; Max Operating Temperature: 155°C; Tolerance: 1%; Packaging: Tape and Reel; Resistor Type: Thin Film; Number of Terminations: 2; Max Power Dissipation: 250mW; Features: Moisture Resistant,Anti-Sulfur; Series: RNCP; Length: 0.079inch; Width: 0.049inch; Height: 0.024inch; Lead Free: Lead Free; RoHS Compliant: Yes; ComponentLink1URL: http://www.seielect.com/Catalog/SEI-rncp.pdf?src-supplier=Future+Electronics; ComponentLink1Description: http://www.seielect.com/Catalog/SEI-rncp.pdf?src-supplier=Future+Electronics; ComponentLink2URL: https://www.seielect.com/Catalog/SEI-rncp.pdf?src-supplier=Digi-Key; ComponentLink2Description: https://www.seielect.com/Catalog/SEI-rncp.pdf?src-supplier=Digi-Key; ComponentLink3URL: https://www.seielect.com/catalog/SEI-Packaging.pdf?src-supplier=Digi-Key; ComponentLink3Description: https://www.seielect.com/catalog/SEI-Packaging.pdf?src-supplier=Digi-Key; Supplier Part Number 1: RNCP0805FTD1K00CT-ND
R22-R25 R27 = RC0805JR-13220RL: Res Thick Film 0805 220 Ohm 5% 0.125W(1/8W) ±100ppm/C Pad SMD T/R; Manufacturer: Yageo; Resistance: 220R; Temperature Coefficient: 100ppm/°C; Power Rating: 125mW; Voltage Rating: 150V; Supplier 1: Digi-Key; Manufacturer Part Number: RC0805JR-13220RL; RoHS: Yes; Category: Chip SMD Resistors; Stock 1: 20198; Pricing 1: 1=0.10000, 10=0.03100, 100=0.01280, 1000=0.00573, 2500=0.00497, 5000=0.00411 (USD); Case/Package: 0805; Contact Plating: Tin,Matte; Case Code (Imperial): 0805; Case Code (Metric): 2012; Min Operating Temperature: -55°C; Max Operating Temperature: 155°C; Tolerance: 5%; Resistor Type: Thick Film; Packaging: Tape and Reel; Termination: SMD/SMT; Series: RC; Construction: Rectangular; Length: 2mm; Width: 1.25mm; Height: 0.5mm; Depth: 1.25mm; Radiation Hardening: No; Military Standard: Not; RoHS Compliant: Yes; ComponentLink1URL: http://www.mouser.com/ds/2/447/Yageo_08112016_RC0805-968729.pdf?src-supplier=Mouser; ComponentLink1Description: http://www.mouser.com/ds/2/447/Yageo_08112016_RC0805-968729.pdf?src-supplier=Mouser; Supplier Part Number 1: 13-RC0805JR-13220RLCT-ND
R28 R29 R38-R42 = RC0805FR-07560RL: Res General Purpose Thick Film 0805 560 Ohm 1% 1/8W ±100ppm/°C Molded Paper T/R; Manufacturer: Yageo; Power Rating: 125mW; Voltage Rating: 150V; Supplier 1: Digi-Key; Manufacturer Part Number: RC0805FR-07560RL; RoHS: Yes; Category: Chip SMD Resistors; Stock 1: 316002; Pricing 1: 1=0.10000, 10=0.03600, 100=0.01480, 1000=0.00666, 2500=0.00578 (USD); Supplier Part Number 1: 311-560CRCT-ND; Case/Package: 0805; Min Operating Temperature: -55°C; Max Operating Temperature: 155°C; Temperature Coefficient: 100ppm/°C; Resistor Type: Thick Film; Packaging: Cut Tape; Tolerance: 1%; Case Code (Metric): 2012; Case Code (Imperial): 0805; Weight: 0.000194oz; Size Code: 0805; Resistance: 560R; Package Quantity: 1; Number of Terminations: 2; Termination: SMD/SMT; Max Power Dissipation: 125mW; Features: Moisture Resistant; Series: RC; Resistance Tolerance: 1%; Construction: Rectangular; Length: 0.079inch; Width: 0.049inch; Height: 0.024inch; Depth: 1.25mm; Lead Free: Lead Free; RoHS Compliant: Yes; Military Standard: Not
SW1 SW2 = 1825910-6: Switch Tactile OFF (ON) SPST Round Button PC Pins 0.05A 24VDC 1.57N Thru-Hole Loose; Manufacturer: TE Connectivity Alcoswitch; Mechanical Life: 100000Cycles; Actuator Material: PBT; Actuator Color: Black; Operating Force: 160gf; Max Voltage Rating (DC): 24V; Contact Resistance: 100mR; Illumination Type: Non-Illuminated,Illuminated; Switch Travel: 0.25mm; Contact Current Rating: 50mA; Switch Function: Off-Mom; Actuator Type: Standard; Actuator Length: 0.055inch; Supplier 1: Digi-Key; Manufacturer Part Number: 1825910-6; RoHS: Yes; Category: Pushbutton Switches; Stock 1: 112137; Pricing 1: 1=0.13000, 10=0.12500, 25=0.11840, 100=0.10780, 250=0.10132, 750=0.09268, 1500=0.07759, 3000=0.07544, 5250=0.07113 (USD); Mount: Through Hole; Contact Material: Copper Alloy; Contact Plating: Silver; Min Operating Temperature: -35°C; Max Operating Temperature: 85°C; Throw Configuration: SPST; Package Quantity: 750; Packaging: Loose Piece; Termination: PC Pins; Electrical Life: 100000Cycles; Orientation: Straight; Type: Switch; Series: FSMJ; Max Current Rating: 50mA; Length: 5.99mm; RoHS Compliant: Yes; ELV: Compliant; Lead Free: Lead Free; ComponentLink1URL: https://datasheet.ciiva.com/30199/1825910-6rqpn1825910-6-30199520.pdf?src-supplier=Onlinecomponents.com; ComponentLink1Description: https://datasheet.ciiva.com/30199/1825910-6rqpn1825910-6-30199520.pdf?src-supplier=Onlinecomponents.com; ComponentLink2URL: https://datasheet.ciiva.com/15184/getdatasheetpartid-395915-15184509.pdf?src-supplier=Verical; ComponentLink2Description: https://datasheet.ciiva.com/15184/getdatasheetpartid-395915-15184509.pdf?src-supplier=Verical; Supplier Part Number 1: 450-1650-ND
U1-U4 = LTV-817S: Photocoupler - Phototransistor Output, 35 V VCEO, -50 to 110 degC, 4-Pin SMD, RoHS, Tape and Reel; Manufacturer: Lite-On; Collector Current (DC): 0.05A; Collector-Emitter Voltage: 35V; Fall Time: 18000ns; Reverse Breakdown Voltage: 6V; Forward Voltage: 1.4V; Output Type: DC; Forward Current: 50mA; Isolation Voltage: 5000V; Number of Elements: 1; Rad Hardened: No; Power Dissipation: 0.2W; Current Transfer Ratio: 600%; DELETED: Compliant; Collector-Emitter Saturation Voltage: 0.2V; Datasheet URL: https://datasheet.ciiva.com/15118/getdatasheetpartid-147501-15118828.pdf; Package Type: PDIPSMD; Collector Current (DC) (Max): 0.05A; Manufacturer URL: http://www.us.liteon.com/; Rise Time: 18000ns; Operating Temperature Classification: Commercial; Output Device: Transistor; Input Type: DC; Datasheet Version: Jan-10; Operating Temp Range: -30Cto100C; Mounting: SurfaceMount; Pin Count: 4; Manufacturer Part Number: LTV-817S
U5 = ESP32-WROOM-32E-H4: Rx Txrx Mod Wifi Trace Ant SMD; Manufacturer: Espressif Systems; Supplier 1: Digi-Key; Manufacturer Part Number: ESP32-WROOM-32E-H4; RoHS: No; Category: Uncategorized; Stock 1: 12159; Pricing 1: 1=3.15000 (USD); Supplier Part Number 1: 1965-ESP32-WROOM-32E-H4CT-ND
U6 = AP63203WU-7: AP63203 Series 3.3 V 2 A SMT Fixed Low IQ Synchronous Buck - TSOT-26; Manufacturer: Diodes; Supplier 1: Digi-Key; Manufacturer Part Number: AP63203WU-7; RoHS: Yes; Category: Voltage Regulators - Switching; Stock 1: 45437; Pricing 1: 1=0.91000, 10=0.79900, 25=0.75040, 100=0.61250, 250=0.56896, 500=0.48420, 1000=0.38737 (USD); Supplier Part Number 1: AP63203WU-7DICT-ND
U7 = AP63205WU-7: AP63205 Series 32 V 2 A 1.1 MHz Synchronous Buck Converter -TSOT-26; Manufacturer: Diodes; Supplier 1: Digi-Key; Manufacturer Part Number: AP63205WU-7; RoHS: Yes; Category: Voltage Regulators - Switching; Stock 1: 147466; Pricing 1: 1=0.91000, 10=0.79900, 25=0.75040, 100=0.61250, 250=0.56896, 500=0.48420, 1000=0.38737 (USD); Supplier Part Number 1: AP63205WU-7DIDKR-ND
U8 U9 = MMPQ3904: MMPQ39 Series NPN 1 W 40 V 200 mA General Purpose Transistor - SOIC-16; Manufacturer: ON Semiconductor / Fairchild; Max Power Dissipation: 1W; Collector Emitter Voltage (VCEO): 40V; Max Collector Current: 200mA; hFE Min: 75; Collector Base Voltage (VCBO): 60V; Emitter Base Voltage (VEBO): 6V; Gain Bandwidth Product: 250MHz; Collector Emitter Saturation Voltage: 100mV; Collector-emitter Voltage-Max: 300mV; Number of Elements: 4; Supplier 1: Digi-Key; Manufacturer Part Number: MMPQ3904; RoHS: Yes; Category: BJTs; Stock 1: 17276; Pricing 1: 1=2.10000, 10=1.88300, 100=1.51340, 500=1.24340, 1000=1.03025 (USD); Mounting Technology: Surface Mount; Case/Package: SOIC; Pins: 16; Weight: 0.143g; Min Operating Temperature: -55°C; Max Operating Temperature: 150°C; Packaging: Tape and Reel; Package Quantity: 48; Polarity: NPN; Collector Emitter Breakdown Voltage: 40V; Voltage Rating (DC): 40V; Current Rating: 200mA; Transition Frequency: 250MHz; Max Breakdown Voltage: 40V; Power Dissipation: 1W; Series: -; Frequency: 250MHz; Clock Frequency: 250MHz; Length: 10mm; Width: 4mm; Height: 1.5mm; Radiation Hardening: No; RoHS Compliant: Yes; Lead Free: Lead Free; Reach SVHC Compliant: Yes; ComponentLink1URL: https://datasheet.ciiva.com/4722/mmpq3904-191413-4722320.pdf?src-supplier=Mouser; ComponentLink1Description: https://datasheet.ciiva.com/4722/mmpq3904-191413-4722320.pdf?src-supplier=Mouser; ComponentLink2URL: https://datasheet.ciiva.com/1193/1727651-1193875.pdf?src-supplier=Element14; ComponentLink2Description: https://datasheet.ciiva.com/1193/1727651-1193875.pdf?src-supplier=Element14; ComponentLink3URL: https://datasheet.ciiva.com/969/mmpq3904-d-969526.pdf?src-supplier=Digi-Key; ComponentLink3Description: https://datasheet.ciiva.com/969/mmpq3904-d-969526.pdf?src-supplier=Digi-Key; ComponentLink4URL: https://datasheet.ciiva.com/15139/getdatasheetpartid-95884-15139210.pdf?src-supplier=Verical; ComponentLink4Description: https://datasheet.ciiva.com/15139/getdatasheetpartid-95884-15139210.pdf?src-supplier=Verical; ComponentLink5URL: https://datasheet.ciiva.com/6362/ffb3904-6362790.pdf?src-supplier=Digi-Key; ComponentLink5Description: https://datasheet.ciiva.com/6362/ffb3904-6362790.pdf?src-supplier=Digi-Key; ComponentLink6URL: https://datasheet.ciiva.com/16776/ffb3904-16776279.pdf?src-supplier=Future+Electronics; ComponentLink6Description: https://datasheet.ciiva.com/16776/ffb3904-16776279.pdf?src-supplier=Future+Electronics; ComponentLink7URL: https://datasheet.ciiva.com/11197/fmb3904-11197433.pdf?src-supplier=Avnet; ComponentLink7Description: https://datasheet.ciiva.com/11197/fmb3904-11197433.pdf?src-supplier=Avnet; ComponentLink8URL: https://datasheet.ciiva.com/11205/fmb3904-11205885.pdf?src-supplier=Avnet; ComponentLink8Description: https://datasheet.ciiva.com/11205/fmb3904-11205885.pdf?src-supplier=Avnet; ComponentLink9URL: https://datasheet.ciiva.com/6362/ffb3904-6362793.pdf?src-supplier=Digi-Key; ComponentLink9Description: https://datasheet.ciiva.com/6362/ffb3904-6362793.pdf?src-supplier=Digi-Key; ComponentLink10URL: https://datasheet.ciiva.com/46415/1785343-46415819.pdf?src-supplier=Element14; ComponentLink10Description: https://datasheet.ciiva.com/46415/1785343-46415819.pdf?src-supplier=Element14; Supplier Part Number 1: MMPQ3904FSCT-ND
U10 = B0505S-1WR3: 1W, i/p: 4.5V ~ 5.5V, single o/p: 5V, SIP; Manufacturer: MORNSUN; Supplier 1: Digi-Key; Manufacturer Part Number: B0505S-1WR3; RoHS: Yes; Category: Board Mount Modules; Stock 1: 49202; Pricing 1: 1=5.23000, 5=5.15200, 10=5.07800, 25=4.92840, 50=4.77900, 100=4.62970, 250=4.48032, 500=4.18162 (USD); Supplier Part Number 1: 2725-B0505S-1WR3-ND